# EAGLE design SparkFun_Thermocouple_Breakout (EAGLE 7.2.0)
DESIGNER: Brent Wilkins; VERSION: v10
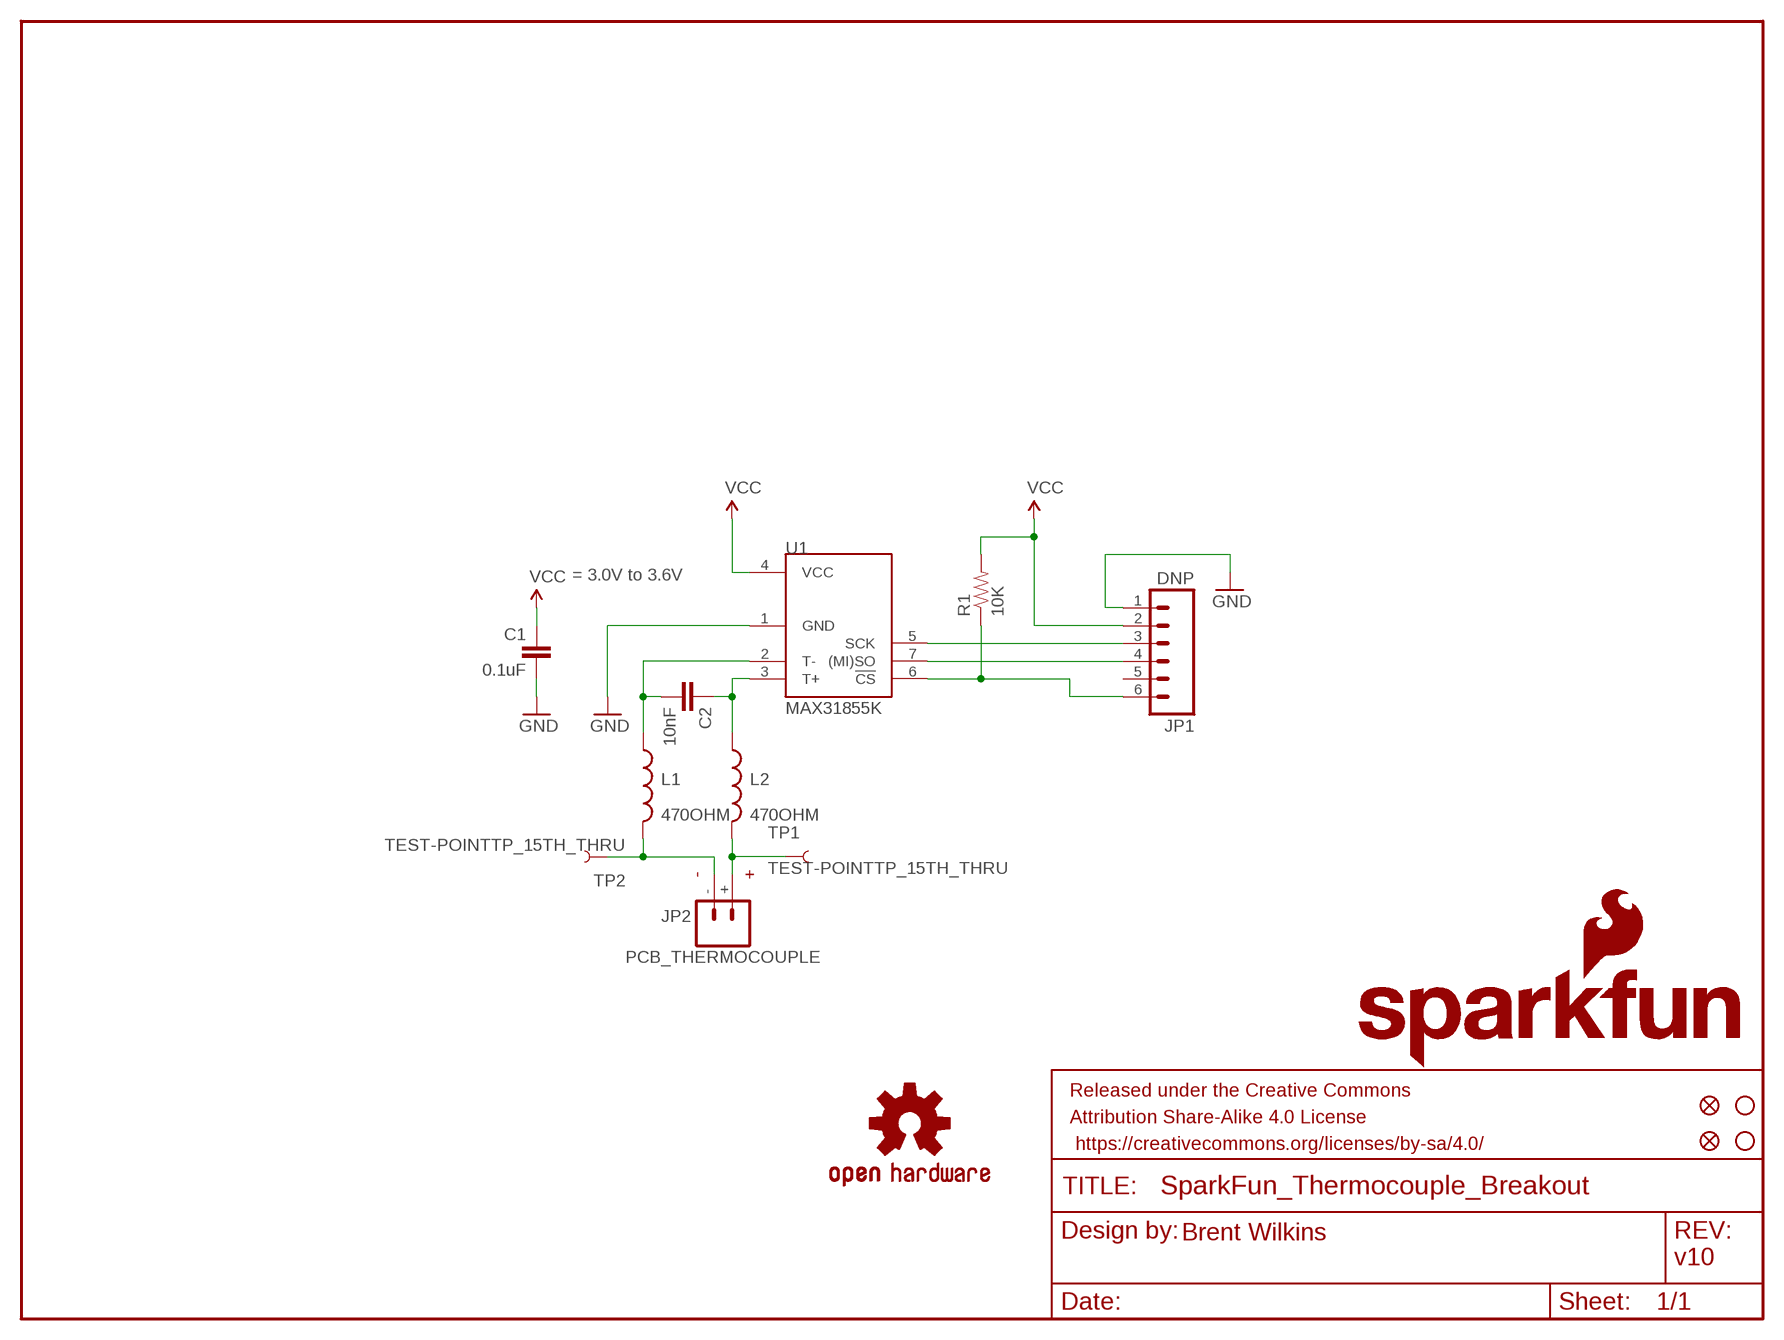
[diagram p0: schematic, sheet 1]

## Parts
C1  0.1uF  0.1UF-25V(+80/-20%)(0603)  [0603-CAP]
C2  10nF  10NF/10000PF-50V-10%(0603)  [0603-CAP]
FID1  FIDUCIAL1X2  [FIDUCIAL-1X2]
FID2  FIDUCIAL1X2  [FIDUCIAL-1X2]
FRAME1  >VERSION  FRAME-LETTER  [CREATIVE_COMMONS]
JP1  DNP  M06SILK_FEMALE_PTH  [1X06]
JP2  PCB_THERMOCOUPLE  [PCC-SMP]
L1  470OHM  INDUCTOR0603  [0603]
L2  470OHM  INDUCTOR0603  [0603]
LOGO1  OSHW-LOGOS  [OSHW-LOGO-S]
LOGO2  SFE_LOGO_NAME_FLAME.1_INCH  [SFE_LOGO_NAME_FLAME_.1]
LOGO3  SFE_LOGO_NAME_FLAME.1_INCH  [SFE_LOGO_NAME_FLAME_.1]
LOGO4  OSHW-LOGOS  [OSHW-LOGO-S]
R1  10K  10KOHM-1/10W-1%(0603)0603  [0603-RES]
STANDOFF1  STAND-OFF  [STAND-OFF]
STANDOFF4  STAND-OFF  [STAND-OFF]
TP1  TEST-POINTTP_15TH_THRU  [TP_15TH]
TP2  TEST-POINTTP_15TH_THRU  [TP_15TH]
U1  MAX31855K  [SOIC8]

## Nets
GND: C1.2 JP1.1 U1.1(GND)
N$1: JP1.3 U1.5(SCK)
N$2: JP1.4 U1.7((MI)SO)
N$3: C2.2 L1.1 U1.2(T-)
N$4: JP2.+ L2.2 TP1.P$1
N$5: JP2.- L1.2 TP2.P$1
N$7: C2.1 L2.1 U1.3(T+)
N$8: JP1.6 R1.1 U1.6(!CS)
VCC: C1.1 JP1.2 R1.2 U1.4(VCC)
Unconnected: JP1.5 JP2.CLIP1 JP2.CLIP2

## Library data of the parts
C1 = SparkFun-Capacitors:0.1UF-25V(+80/-20%)(0603): CAP-00810 Ceramic Standard decoupling cap; PROD_ID: CAP-00810
C2 = SparkFun-Capacitors:10NF/10000PF-50V-10%(0603): CAP-00867; PROD_ID: CAP-00867
FID1 FID2 = SparkFun-Aesthetics:FIDUCIAL: Fiducial Alignment Points Various fiducial points for machine vision alignment.
FRAME1 = SparkFun-Aesthetics:FRAME-LETTER: Schematic Frame Standard 8.5x11 US Letter frame; DESIGNER: Brent Wilkins; VERSION: v01
JP1 = SparkFun-Connectors:M06: Header 6 Standard 6-pin 0.1" header. Use with straight break away headers (SKU : PRT-00116), right angle break away headers (PRT-00553), swiss pins (PRT-00743), machine pins (PRT-00117), and female headers (PRT-00115). Molex polarized connector foot print use with SKU : PRT-08094 with associated crimp pins and housings. NOTES ON THE VARIANTS LOCK and LOCK_LONGPADS... This footprint was designed to help hold the alignment of a through-hole component (i.e. 6-pin header) while soldering it into place. You may notice that each hole has been shifted either up or down by 0.005 of an inch from it's more standard position (which is a perfectly straight line). This slight alteration caused the pins (the squares in the middle) to touch the edges of the holes. Because they are alternating, it causes a "brace" to hold the component in place. 0.005 has proven to be the perfect amount of "off-center" position when using our standard breakaway headers. Although looks a little odd when you look at the bare footprint, once you have a header in there, the alteration is very hard to notice. Also,if you push a header all the way into place, it is covered up entirely on the bottom side. This idea of altering the position of holes to aid alignment will be further integrated into the Sparkfun Library for other footprints. It can help hold any component with 3 or more connection pins.; PROD_ID: CONN-08437
JP2 = Testing:PCB_THERMOCOUPLE: Circuit Board Thermocouple Connectors Glass-Filled Nylon 220°C (425°F) The PCC connector from OMEGA is perfect for bringing thermocouple probes to printed circuit boards. (OMEGA PCC-SMP) For type-k thermocouples.
L1 L2 = SparkFun-Passives:INDUCTOR: Inductors Basic Inductor/Choke - 0603 and 1206. Footprints are not proven and vary greatly between part numbers. INDUCTOR POWER 3.3UH 4.0A SMD 0.197" L x 0.197" W x 0.177" H (5.00mm x 5.00mm x 4.50mm); PROD_ID: NDUC-12579
LOGO1 LOGO4 = SparkFun-Aesthetics:OSHW-LOGO: Open Source Hardware Logo This logo indicates the piece of hardware it is found on incorporates a OSHW license and/or adheres to the definition of open source hardware found here: http://freedomdefined.org/OSHW
LOGO2 LOGO3 = SparkFun-Aesthetics:SFE_LOGO_NAME_FLAME: SFE Logo, name and flame This is the SparkFun full logo. The logo on the schematic will always be the same size; the package variant is the height of the flame part of the logo. Default layer for the logo on the board is tSilk.
R1 = SparkFun-Resistors:10KOHM-1/10W-1%(0603): RES-00824; PROD_ID: RES-00824
STANDOFF1 STANDOFF4 = SparkFun-Electromechanical:STAND-OFF: #4 Stand Off This is the mechanical footprint for a #4 phillips button head screw. Use the keepout ring to avoid running the screw head into surrounding components. SKU : PRT-00447
TP1 TP2 = SparkFun-Passives:TEST-POINT: Bare copper test points for troubleshooting or ICT
U1 = SparkFun-AnalogIC:MAX31855K: Cold-Junction-Compensated K-Thermocoupleto-Digital Converter (-270°C to +1800°C) The MAX31855K performs cold-junction compensation and digitizes the signal from a type-K thermocouple. The data is output in a 14-bit resolution, SPI™-compatible, read-only format. This converter resolves temperatures to 0.25°C, allows readings as high as +1800°C and as low as -270°C, and exhibits thermocouple accuracy of ±2°C for temperatures ranging from -200°C to +700°C for K-type thermocouples.; PROD_ID: IC-12578

## Board
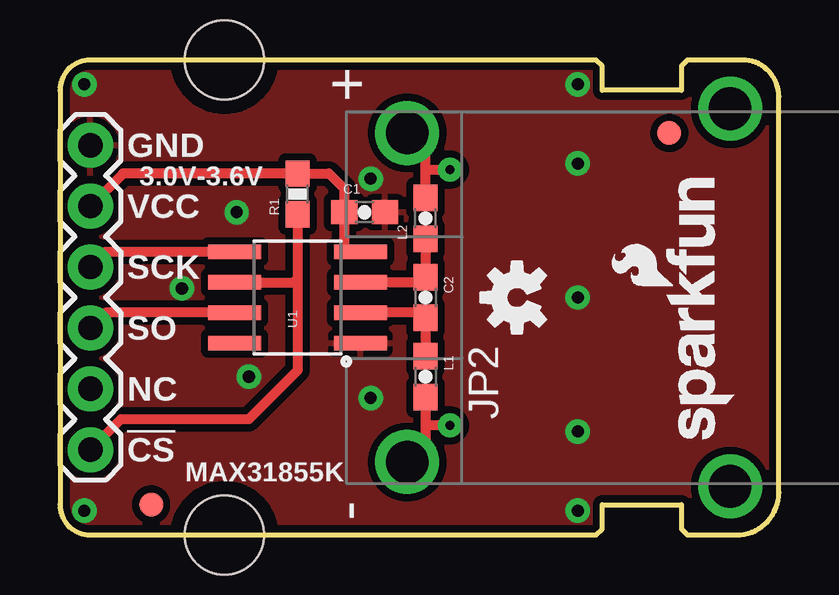
[diagram p1: board, top side]
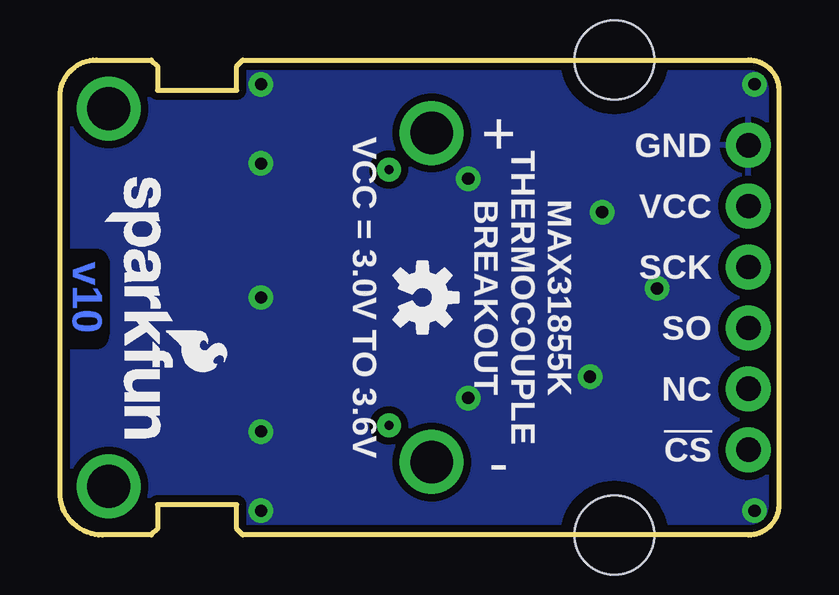
[diagram p2: board, bottom side, seen from below]

Size 29.97 x 19.81 mm. Coordinates in mm from the lower left corner, seen from the top.
Outline: 29.97,1.78 29.97,18.29 arc90 28.45,19.81 26.16,19.81 25.91,19.56 25.91,18.54 22.61,18.54 22.61,19.56 22.35,19.81 1.27,19.81 arc90 0,18.54 0,1.27 arc90 1.27,0 22.35,0 22.61,0.25 22.61,1.27 25.91,1.27 25.91,0.25 26.16,0 28.19,0 arc90 29.97,1.78
Copper layers (1*16): Top 0.035mm / dielectric 1.5mm / Bottom 0.035mm
Design rules "SparkFun-2-layer": minimum track width 7mil, minimum drill 15mil, track to track 8mil, track to pad 8mil, pad to pad 8mil, via to via 8mil, smd to smd 8mil, copper to edge 8mil, drill to drill 8mil, minimum pad ring 12mil, minimum via ring 10mil, stop-mask expansion 4mil, vias tented up to drill 20mil, thermal gap 10mil
tRestrict: area 12.7,8.4 to 13.2,8.9
bRestrict: area 28.4,8.3 to 30,11.4

### Footprints (pad centres in the part's own frame; a part is rotated, then mirrored left to right if it is on the bottom)
0603-CAP = smd 1.1 x 1: 1 -0.85,0; 2 0.85,0
FIDUCIAL-1X2 = smd 1 x 1: 1 0,0
1X06 = drill 1.016 pad 1.88: 1 0,0; 2 2.54,0; 3 5.08,0; 4 7.62,0; 5 10.16,0; 6 12.7,0
PCC-SMP = drill 1.778: + 6.858,0; - -6.858,0; CLIP1 -7.874,-13.462; CLIP2 7.874,-13.462
0603 = smd 1.1 x 1: 1 -0.85,0; 2 0.85,0
0603-RES = smd 1.1 x 1: 1 -0.85,0; 2 0.85,0
STAND-OFF = hole 3.302: 0,0
TP_15TH = drill 0.381 pad 0.61: P$1 0,0
SOIC8 = smd 0.61 x 2.21: 1 -1.905,-2.616; 2 -0.635,-2.616; 3 0.635,-2.616; 4 1.905,-2.616; 5 1.905,2.616; 6 0.635,2.616; 7 -0.635,2.616; 8 -1.905,2.616

### Placement (x,y rotation side)
C1  12.7,13.46 0 top
C2  15.24,9.91 270 top
FID1  25.4,16.76 0 top
FID2  3.81,1.27 0 top
FRAME1  -8.56,-12.67 0 top  (outside the outline)
JP1  1.27,16.26 270 top
JP2  14.48,9.91 90 top
L1  15.24,6.6 270 top
L2  15.24,13.21 90 top
LOGO1  19.05,9.91 90 top
LOGO2  28.19,3.56 90 top
LOGO3  28.19,15.37 270 bottom
LOGO4  14.86,9.91 270 bottom
R1  9.91,14.22 90 top
STANDOFF1  6.86,0 0 top
STANDOFF4  6.86,19.81 0 top
TP1  16.26,15.24 0 top
TP2  16.26,4.57 0 top
U1  9.91,9.91 90 top

### Tracks (layer width: path | path; a pad name or v marks a point on that pad's centre or on a via)
GND  (via drill 0.51)
  other vias: 7.87,6.6 5.08,10.29 7.37,13.46 21.59,18.8 1.02,18.8 1.02,1.02 21.59,1.02 21.59,15.49 21.59,9.91 21.59,4.32 12.95,5.71 12.95,14.86
  pour Top (isolate 0.305, rank 6): 0,19.81 29.97,19.81 29.97,0 0,0
  pour Bottom (isolate 0.305, rank 6): 0,19.81 29.97,19.81 29.97,0 0,0
N$1
  Top 0.406: U1.5 1.91,11.81 JP1.3
N$2
  Top 0.406: U1.7 1.91,9.27 JP1.4
N$3
  Top 0.406: L1.1 C2.2 15.03,9.27 U1.2
N$4
  Top 0.406: JP2.+ 15.24,16 L2.2 15.24,15.24 TP1.P$1
N$5
  Top 0.406: L1.2 15.24,4.57 | 15.24,4.57 15.24,3.81 JP2.- | TP2.P$1 15.24,4.57
N$7
  Top 0.406: L2.1 C2.1 15.03,10.54 U1.3
N$8
  Top 0.406: R1.1 9.91,10.67 | 9.91,10.67 9.91,6.86 7.87,4.83 2.54,4.83 JP1.6 | U1.6 9.78,10.54 9.91,10.67
VCC
  Top 0.406: 11.68,13.3 C1.1 | JP1.2 2.63,15.07 R1.2 11.21,15.07 11.85,14.44 C1.1 | C1.1 11.85,11.81 U1.4

### Text on the board
tPlace: GND | 3.0V-3.6V | VCC | SCK | SO | NC | !CS | MAX31855K
bPlace: + | GND | VCC | SCK | MAX31855K / THERMOCOUPLE / BREAKOUT | VCC = 3.0V TO 3.6V | SO | NC | !CS | -
Measures: All units in inches